# EAGLE schematic megy_dole_v1 (EAGLE 6.3)
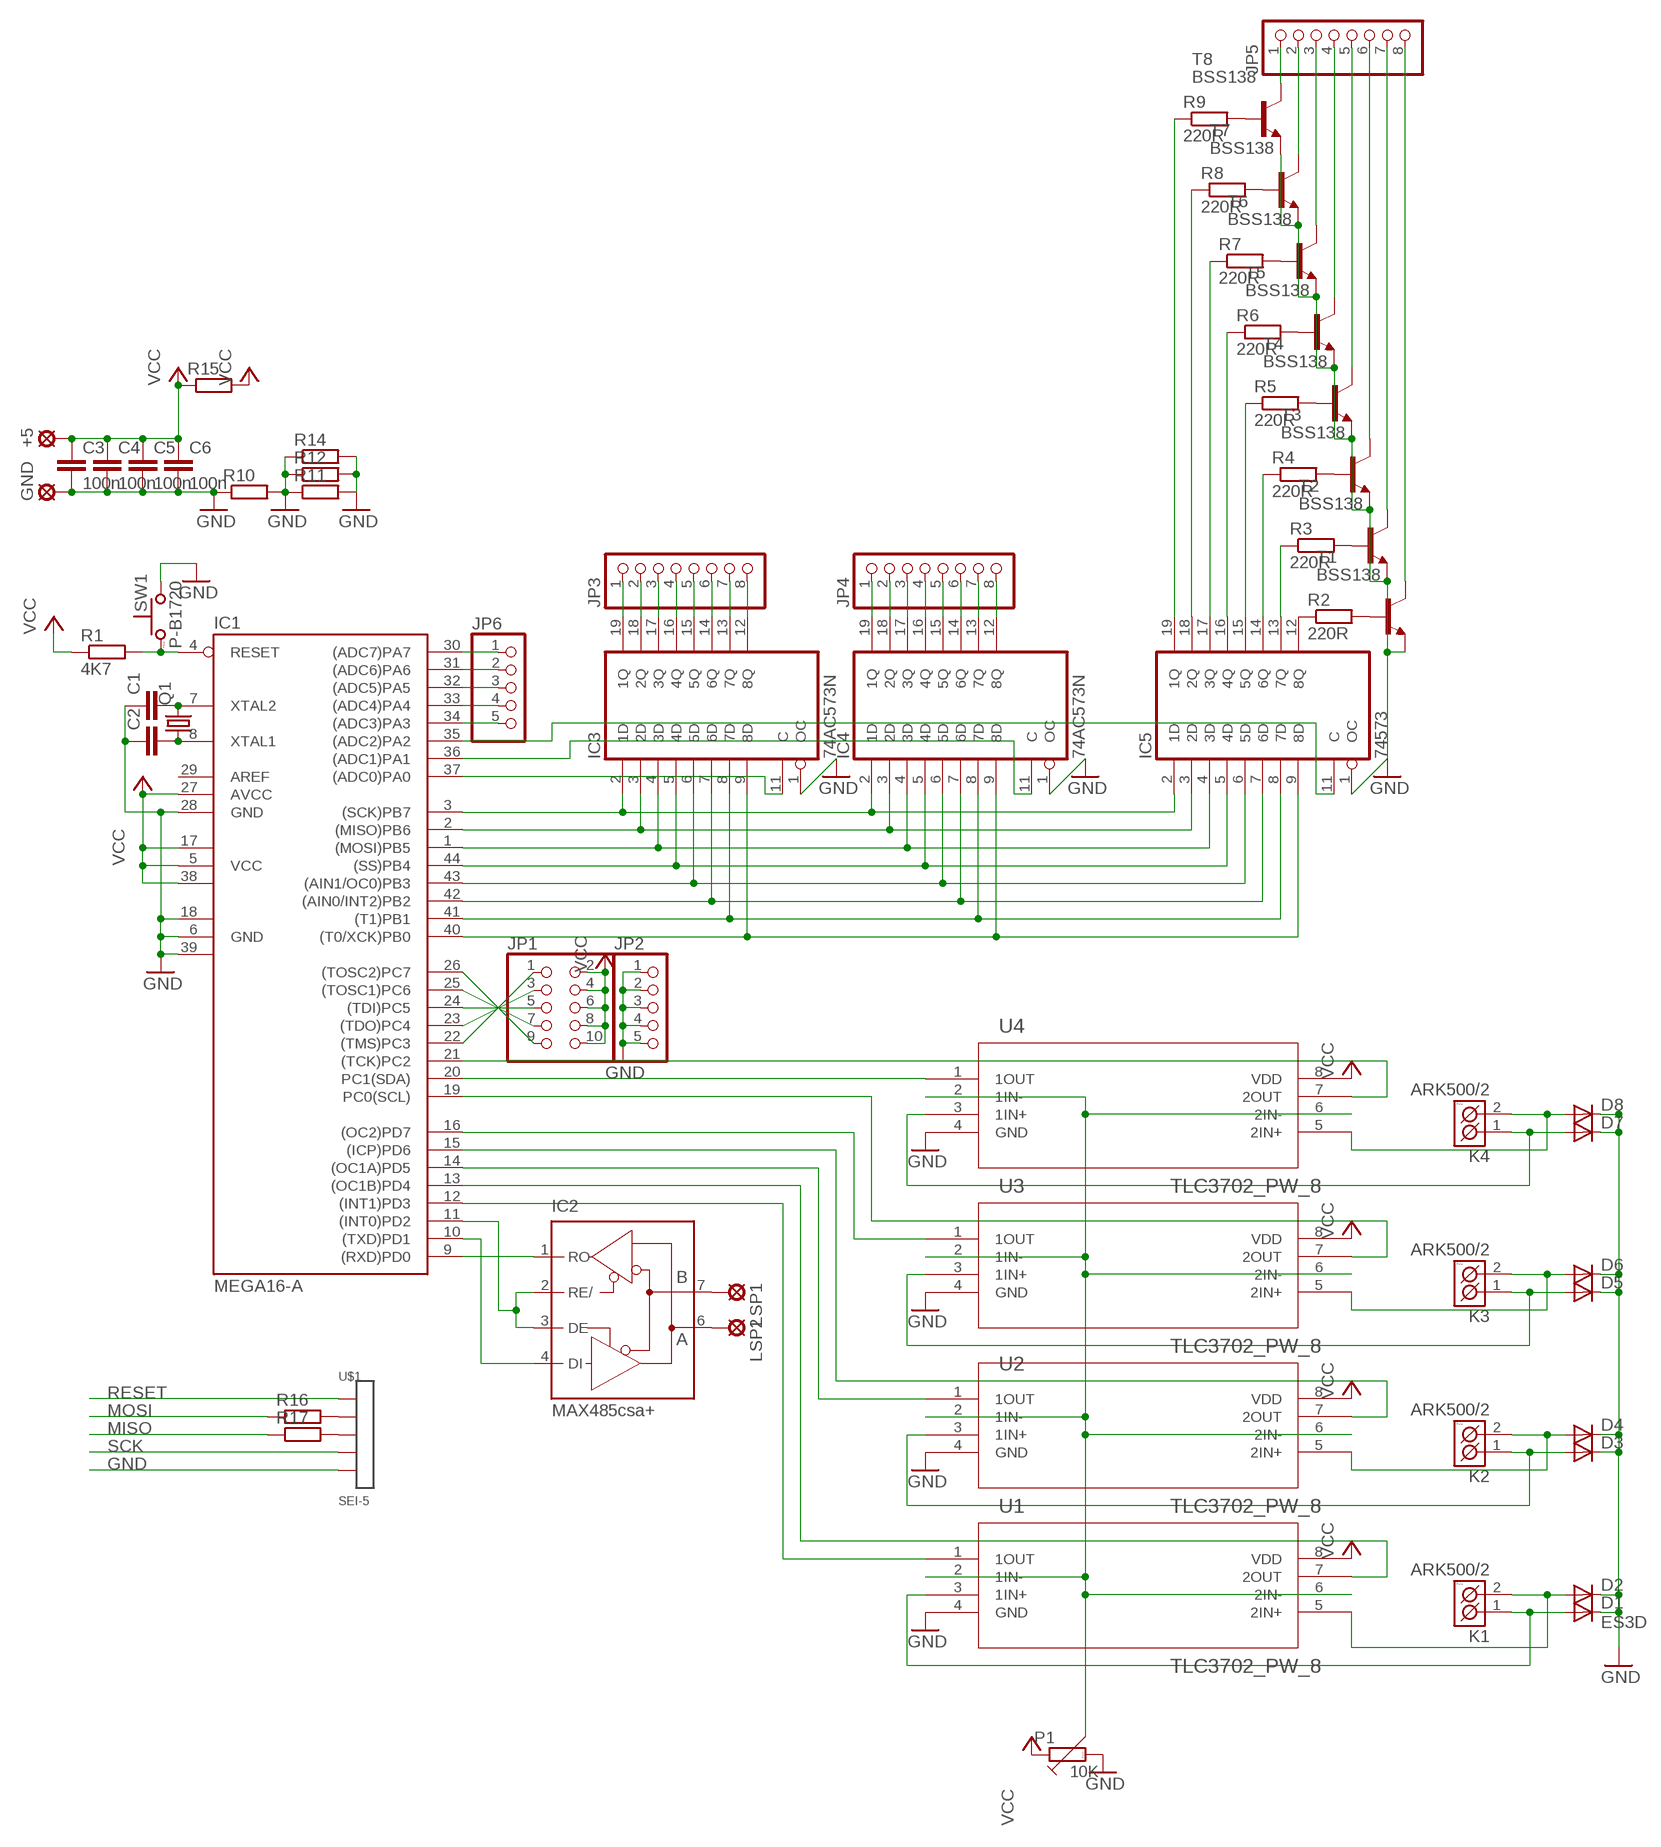
[diagram p0: schematic, sheet 1]

## Parts
+5  LSP10  [LSP10]
C1  C-EUC0603  [C0603]
C2  C-EUC0603  [C0603]
C3  100n  C-EUC0504  [C0504]
C4  100n  C-EUC0504  [C0504]
C5  100n  C-EUC0504  [C0504]
C6  100n  C-EUC0504  [C0504]
D1  ES3D  DIODE-SMC  [SMC]
D2  DIODE-SMC  [SMC]
D3  DIODE-SMC  [SMC]
D4  DIODE-SMC  [SMC]
D5  DIODE-SMC  [SMC]
D6  DIODE-SMC  [SMC]
D7  DIODE-SMC  [SMC]
D8  DIODE-SMC  [SMC]
GND  LSP10  [LSP10]
IC1  MEGA16-A  [TQFP44]
IC2  MAX485csa+  MAX481CSA  [SO08]
IC3  74AC573N  [DIL20]
IC4  74AC573N  [DIL20]
IC5  74573  [PW20]
JP1  PINHD-2X5  [2X05]
JP2  PINHD-1X5  [1X05]
JP3  PINHD-1X8  [1X08]
JP4  PINHD-1X8  [1X08]
JP5  PINHD-1X8  [1X08]
JP6  PINHD-1X5  [1X05]
K1  ARK500/2  [ARK500/2]
K2  ARK500/2  [ARK500/2]
K3  ARK500/2  [ARK500/2]
K4  ARK500/2  [ARK500/2]
LSP1  LSP10  [LSP10]
LSP2  LSP10  [LSP10]
P1  10K  TRIMRPM19  [PM19]
Q1  CRYSTALHC49UP  [HC49UP]
R1  4K7  R-EU_R0402  [R0402]
R2  220R  R-EU_R0402  [R0402]
R3  220R  R-EU_R0402  [R0402]
R4  220R  R-EU_R0402  [R0402]
R5  220R  R-EU_R0402  [R0402]
R6  220R  R-EU_R0402  [R0402]
R7  220R  R-EU_R0402  [R0402]
R8  220R  R-EU_R0402  [R0402]
R9  220R  R-EU_R0402  [R0402]
R10  R-EU_R1206  [R1206]
R11  R-EU_R1206  [R1206]
R12  R-EU_R1206  [R1206]
R14  R-EU_R1206  [R1206]
R15  R-EU_R1206  [R1206]
R16  R-EU_R1206  [R1206]
R17  R-EU_R1206  [R1206]
SW1  P-B1720  [P-B1720]
T1  BSS138  BC846  [SOT23]
T2  BSS138  BC846  [SOT23]
T3  BSS138  BC846  [SOT23]
T4  BSS138  BC846  [SOT23]
T5  BSS138  BC846  [SOT23]
T6  BSS138  BC846  [SOT23]
T7  BSS138  BC846  [SOT23]
T8  BSS138  BC846  [SOT23]
U1  TLC3702_PW_8  [PW8]
U2  TLC3702_PW_8  [PW8]
U3  TLC3702_PW_8  [PW8]
U4  TLC3702_PW_8  [PW8]
U$1  SEI-5  [SEI-5]

## Nets
GND: C1.1 C2.1 C3.2 C4.2 C5.2 C6.2 D1.C D2.C D3.C D4.C D5.C D6.C D7.C D8.C GND.MP IC1.6(GND) IC1.18(GND1) IC1.28(GND) IC1.39(GND2) IC3.1(OC) IC4.1(OC) IC5.1(OC) JP2.1 JP2.2 JP2.3 JP2.4 JP2.5 P1.B R10.1 R10.2 R11.1 R11.2 R12.1 R12.2 R14.1 R14.2 SW1.2 T1.2(E) T2.2(E) T3.2(E) T4.2(E) T5.2(E) T6.2(E) T7.2(E) T8.2(E) U1.4(GND) U2.4(GND) U3.4(GND) U4.4(GND) U$1.P$5
MISO: IC1.2((MISO)PB6) IC3.3(2D) IC4.3(2D) IC5.3(2D) R17.1
MOSI: IC1.1((MOSI)PB5) IC3.4(3D) IC4.4(3D) IC5.4(3D) R16.1
N$1: IC1.10((TXD)PD1) IC2.4(DI)
N$2: IC1.11((INT0)PD2) IC2.2(RE/) IC2.3(DE)
N$3: IC2.7(B) LSP1.MP
N$4: IC1.9((RXD)PD0) IC2.1(RO)
N$5: IC1.37((ADC0)PA0) IC3.11(C)
N$6: IC2.6(A) LSP2.MP
N$7: C1.2 IC1.7(XTAL2) Q1.2
N$8: C2.2 IC1.8(XTAL1) Q1.1
N$9: IC1.26((TOSC2)PC7) JP1.9
N$10: IC1.25((TOSC1)PC6) JP1.7
N$11: IC1.24((TDI)PC5) JP1.5
N$12: IC1.23((TDO)PC4) JP1.3
N$13: IC1.22((TMS)PC3) JP1.1
N$14: IC1.40((T0/XCK)PB0) IC3.9(8D) IC4.9(8D) IC5.9(8D)
N$15: IC1.41((T1)PB1) IC3.8(7D) IC4.8(7D) IC5.8(7D)
N$16: IC1.42((AIN0/INT2)PB2) IC3.7(6D) IC4.7(6D) IC5.7(6D)
N$17: IC1.12((INT1)PD3) U1.1(1OUT)
N$18: IC1.13((OC1B)PD4) U1.7(2OUT)
N$19: IC1.20(PC1(SDA)) U4.1(1OUT)
N$20: D1.A K1.1(K1) U1.3(1IN+)
N$21: D2.A K1.2(K2) U1.5(2IN+)
N$22: IC1.43((AIN1/OC0)PB3) IC3.6(5D) IC4.6(5D) IC5.6(5D)
N$23: IC1.44((SS)PB4) IC3.5(4D) IC4.5(4D) IC5.5(4D)
N$24: IC1.21((TCK)PC2) U4.7(2OUT)
N$25: D7.A K4.1(K1) U4.3(1IN+)
N$26: D8.A K4.2(K2) U4.5(2IN+)
N$27: P1.C U1.2(1IN-) U1.6(2IN-) U2.2(1IN-) U2.6(2IN-) U3.2(1IN-) U3.6(2IN-) U4.2(1IN-) U4.6(2IN-)
N$28: IC1.14((OC1A)PD5) U2.1(1OUT)
N$29: IC1.15((ICP)PD6) U2.7(2OUT)
N$30: D3.A K2.1(K1) U2.3(1IN+)
N$31: D4.A K2.2(K2) U2.5(2IN+)
N$32: IC1.16((OC2)PD7) U3.1(1OUT)
N$33: IC1.19(PC0(SCL)) U3.7(2OUT)
N$34: D5.A K3.1(K1) U3.3(1IN+)
N$35: D6.A K3.2(K2) U3.5(2IN+)
N$36: R16.2 U$1.P$2
N$37: R17.2 U$1.P$3
N$39: IC4.19(1Q) JP4.1
N$40: IC4.18(2Q) JP4.2
N$41: IC4.17(3Q) JP4.3
N$42: IC4.16(4Q) JP4.4
N$43: IC3.19(1Q) JP3.1
N$44: IC3.18(2Q) JP3.2
N$45: IC3.17(3Q) JP3.3
N$46: IC3.16(4Q) JP3.4
N$47: IC3.15(5Q) JP3.5
N$48: IC3.14(6Q) JP3.6
N$49: IC3.13(7Q) JP3.7
N$50: IC3.12(8Q) JP3.8
N$51: IC4.15(5Q) JP4.5
N$52: IC4.14(6Q) JP4.6
N$53: IC4.13(7Q) JP4.7
N$54: IC4.12(8Q) JP4.8
N$55: IC1.36((ADC1)PA1) IC4.11(C)
N$57: IC1.35((ADC2)PA2) IC5.11(C)
N$58: IC5.12(8Q) R2.1
N$59: R2.2 T1.1(B)
N$60: JP5.8 T1.3(C)
N$61: R3.2 T2.1(B)
N$62: IC5.13(7Q) R3.1
N$63: JP5.7 T2.3(C)
N$64: IC5.19(1Q) R9.1
N$65: R4.2 T3.1(B)
N$66: IC5.14(6Q) R4.1
N$67: JP5.6 T3.3(C)
N$68: R5.2 T4.1(B)
N$69: R6.2 T5.1(B)
N$70: R7.2 T6.1(B)
N$71: R8.2 T7.1(B)
N$72: R9.2 T8.1(B)
N$73: JP5.5 T4.3(C)
N$74: JP5.4 T5.3(C)
N$75: JP5.3 T6.3(C)
N$76: JP5.2 T7.3(C)
N$77: JP5.1 T8.3(C)
N$78: IC5.18(2Q) R8.1
N$79: IC5.17(3Q) R7.1
N$80: IC5.16(4Q) R6.1
N$81: IC5.15(5Q) R5.1
N$82: IC1.30((ADC7)PA7) JP6.1
N$83: IC1.31((ADC6)PA6) JP6.2
N$84: IC1.32((ADC5)PA5) JP6.3
N$85: IC1.33((ADC4)PA4) JP6.4
N$86: IC1.34((ADC3)PA3) JP6.5
RESET: IC1.4(RESET) R1.2 SW1.1 U$1.P$1
SCK: IC1.3((SCK)PB7) IC3.2(1D) IC4.2(1D) IC5.2(1D) U$1.P$4
VCC: +5.MP C3.1 C4.1 C5.1 C6.1 IC1.5(VCC) IC1.17(VCC1) IC1.27(AVCC) IC1.38(VCC2) JP1.2 JP1.4 JP1.6 JP1.8 JP1.10 P1.A R1.1 R15.1 R15.2 U1.8(VDD) U2.8(VDD) U3.8(VDD) U4.8(VDD)
Unconnected: IC1.29(AREF) SW1.3 SW1.4

## Power pins joined to a net without a drawn wire
GND: IC2.5(GND) IC3.10(GND) IC4.10(GND) IC5.10(GND)
VCC: IC2.8(VCC) IC3.20(VCC) IC4.20(VCC) IC5.20(VCC)

## Library data of the parts
+5 GND LSP1 LSP2 = solpad:LSP10: SOLDER PAD drill 1.0 mm, distributor Buerklin, 12H555
C1-C6 = rcl:C-EU: CAPACITOR, European symbol
D1-D8 = diode:DIODE-: DIODE
IC1 = atmel:MEGA16: MICROCONTROLLER 16 Kbytes FLASH 1 kbytes SRAM 512 bytes EEPROM USART 8-channel 10 bit ADC Source: avr.lbr; MPN: ATMEGA16-16AU; OC_FARNELL: 9171134; OC_NEWARK: 96K6515
IC2 = maxim:MAX481CSA: RS485 TRANSEIVER; MF: MAXIM; MPN: MAX481CSA; OC_FARNELL: unknown; OC_NEWARK: 90C3817
IC3-IC5 = 74xx-eu:74*573: 8-bit D latch BUS DRIVER
JP1 = pinhead:PINHD-2X5: PIN HEADER
JP2 JP6 = pinhead:PINHD-1X5: PIN HEADER
JP3-JP5 = pinhead:PINHD-1X8: PIN HEADER
K1-K4 = #PaJa_konektory:ARK500/2: Svorkovnice - roztec 5mm - dvojita
P1 = #PaJa_30:TRIMR: Trimr
Q1 = crystal:CRYSTAL: CRYSTAL; OC_FARNELL: unknown; OC_NEWARK: unknown
R1-R12 R14-R17 = rcl:R-EU_: RESISTOR, European symbol
SW1 = #PaJa_prepinace:P-B1720: µ-tlacitko
T1-T8 = transistor:BC846: NPN TRANSISTOR
U1-U4 = texas:TLC3702_PW_8; DATASHEETURL: http://www.ti.com/lit/gpn/TLC3702; DESCRIPTION: Dual, Micropower, Push-Pull Outputs, LinCMOS(TM) Voltage Comparator; FAMILY_NAME: COMPARATOR; GENERIC_PART_NUMBER: TLC3702; INDUSTRY_STD_PKG_TYPE: TSSOP; MANUFACTURER: Texas Instruments; MANUFACTURER_PART_NUMBER: tlc3702_pw_8; PACKAGE_DESIGNATOR: PW; PIN_COUNT: 8; VENDOR: Texas Instruments
U$1 = con-samtec:SEI-5